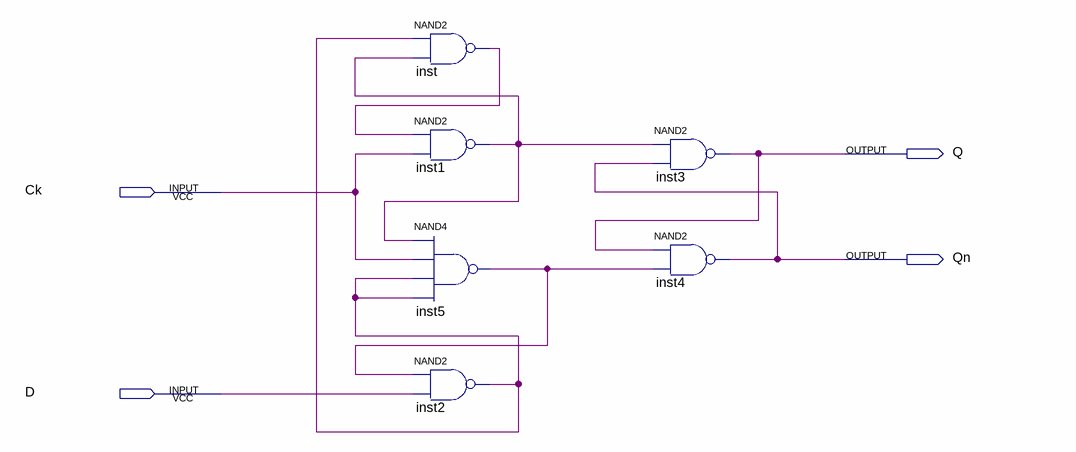
[diagram p0: schematic sheet]
// Quartus schematic DFFNO.bdf as structural Verilog: 6 symbols, 4 pins
module DFFNO (
  input  Ck,
  input  D,
  output Q,
  output Qn
);

  wire inst1_out, inst2_out, inst5_out, inst_out;

  nand inst (inst_out, inst2_out, inst1_out);
  nand inst1 (inst1_out, inst_out, Ck);
  nand inst5 (inst5_out, inst1_out, Ck, inst2_out, inst2_out);
  nand inst2 (inst2_out, inst5_out, D);
  nand inst3 (Q, inst1_out, Qn);
  nand inst4 (Qn, Q, inst5_out);
endmodule
